# Altium schematic sheet Connectors.SchDoc
size A; SheetNumber: 1; SheetTotal: 6
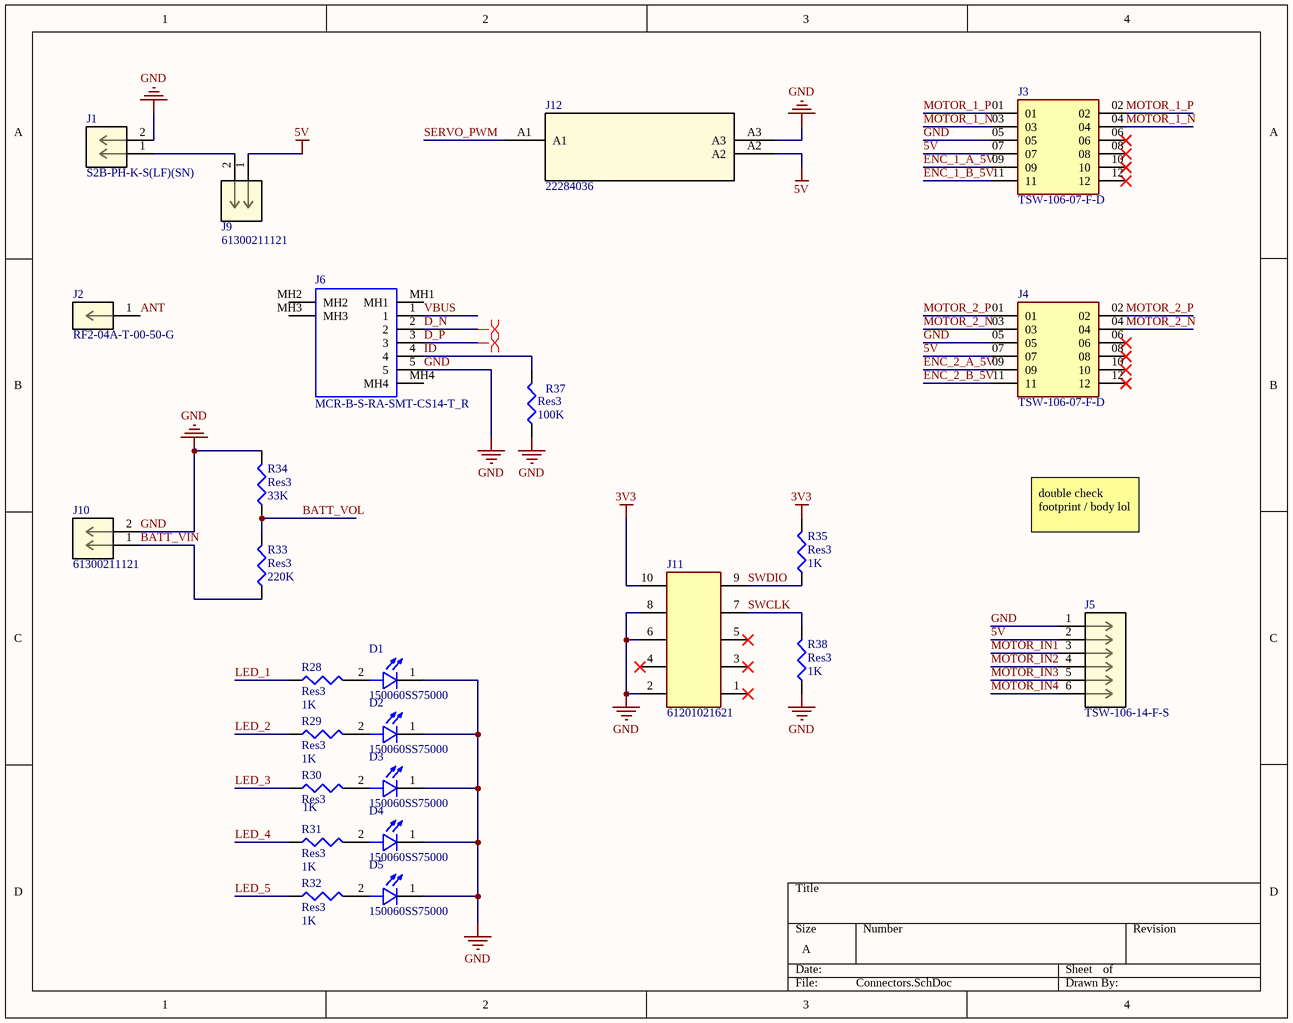
[diagram p0: Connectors.SchDoc]

## Parts
D1  150060SS75000  [LED_150060SS75000]
D2  150060SS75000  [LED_150060SS75000]
D3  150060SS75000  [LED_150060SS75000]
D4  150060SS75000  [LED_150060SS75000]
D5  150060SS75000  [LED_150060SS75000]
J1  S2B-PH-K-S(LF)(SN)  [CONN_S2B-PH-K-S_JST]
J2  RF2-04A-T-00-50-G  [CONN_RF2-04A-T-00-50-G_ADM]
J3  TSW-106-07-F-D  [SAMTEC_TSW-106-07-F-D]
J4  TSW-106-07-F-D  [SAMTEC_TSW-106-07-F-D]
J5  TSW-106-14-F-S  [CON6_1X6_TU_TSW]
J6  MCR-B-S-RA-SMT-CS14-T_R  [MCRBSRASMTCS14TR]
J9  61300211121  [CONN_61300211121_WRE]
J10  61300211121  [CONN_61300211121_WRE]
J11  61201021621  [61201021621]
J12  22284036  [22-28-4036_MOL]
R28  Res3  value 1K  [J1-0603]
R29  Res3  value 1K  [J1-0603]
R30  Res3  value 1K  [J1-0603]
R31  Res3  value 1K  [J1-0603]
R32  Res3  value 1K  [J1-0603]
R33  Res3  value 220K  [J1-0603]
R34  Res3  value 33K  [J1-0603]
R35  Res3  value 1K  [J1-0603]
R37  Res3  value 100K  [J1-0603]
R38  Res3  value 1K  [J1-0603]

## Nets
3V3: J11.10 R35.2
5V: J3.07 J4.07 J5.2 J9.1 J12.A2
GND: D1.1(C) D2.1(C) D3.1(C) D4.1(C) D5.1(C) J1.2 J3.05 J4.05 J5.1 J6.5 J10.2 J11.2 J11.6 J11.8 J12.A3 R34.2 R37.1 R38.1
ANT: J2.1
BATT_VIN: J10.1 R33.1
BATT_VOL: R33.2 R34.1
D_N: J6.2
D_P: J6.3
ENC_1_A_5V: J3.09
ENC_1_B_5V: J3.11
ENC_2_A_5V: J4.09
ENC_2_B_5V: J4.11
ID: J6.4 R37.2
LED_1: R28.1
LED_2: R29.1
LED_3: R30.1
LED_4: R31.1
LED_5: R32.1
MOTOR_1_N: J3.03 J3.04
MOTOR_1_P: J3.01 J3.02
MOTOR_2_N: J4.03 J4.04
MOTOR_2_P: J4.01 J4.02
MOTOR_IN1: J5.3
MOTOR_IN2: J5.4
MOTOR_IN3: J5.5
MOTOR_IN4: J5.6
SERVO_PWM: J12.A1
SWCLK: J11.7 R38.2
SWDIO: J11.9 R35.1
VBUS: J6.1
NetD1_2: D1.2(A) R28.2
NetD2_2: D2.2(A) R29.2
NetD3_2: D3.2(A) R30.2
NetD4_2: D4.2(A) R31.2
NetD5_2: D5.2(A) R32.2
NetJ1_1: J1.1 J9.2

Not connected (* = marked no-connect by the designer): J3 06* 08* 10* 12*; J4 06* 08* 10* 12*; J6 MH1 MH2 MH3 MH4; J11 1* 3* 4* 5*

## Layout directives
differential pair: D_N, D_P

## Notes on the sheet
- double check footprint / body lol

## Library data of the parts
D1-D5 = 150060SS75000: Standard LEDs - SMD WL-SMCW SMDMono TpVw Waterclr 0603 SprRed; MF: WÃ¼rth Elektronik; SnapEDA_Link: https://www.snapeda.com/parts/150060SS75000/W%C3%BCrth%20Elektronik/view-part/4805427/?ref=snap; Availability: Warning; Purchase-URL: https://pricing.snapeda.com/search/part/150060SS75000/?ref=eda; MP: 150060SS75000; Value: *; Price: None; Package: None; Check_prices: https://www.snapeda.com/parts/150060SS75000/W%C3%BCrth%20Elektronik/view-part/4805427/?ref=eda
J1 = S2B-PH-K-S(LF)(SN): No Description Available; Mfr_Name: JST; Copyright: Copyright (C) 2023 Ultra Librarian. All rights reserved.; Manufacturer_Part_Number: S2B-PH-K-S(LF)(SN); Digi-Key_Part_Number_1: 455-1719-ND; Digi-Key_Part_Number_2: 455-1719-NDL; RefDes: RefDes; Type: DEV
J2 = RF2-04A-T-00-50-G: No Description Available; Mfr_Name: ADAM TECHNOLOGIES INC; Copyright: Copyright (C) 2023 Ultra Librarian. All rights reserved.; Manufacturer_Part_Number: RF2-04A-T-00-50-G; Digi-Key_Part_Number_1: 2057-RF2-04A-T-00-50-G-ND; RefDes: RefDes; Type: DEV
J3 J4 = TSW-106-07-F-D: MF: Samtec; MP: TSW-106-07-F-D; Price: None; Package: None; Value: *; Availability: Unavailable
J5 = TSW-106-14-F-S: No Description Available; Mfr_Name: Samtec Inc; Copyright: Copyright (C) 2023 Ultra Librarian. All rights reserved.; Manufacturer_Part_Number: TSW-106-14-F-S; Digi-Key_Part_Number_1: SAM15379-ND; Digi-Key_Part_Number_2: TSW-106-14-F-S-ND; RefDes: RefDes; Type: DEV
J6 = MCR-B-S-RA-SMT-CS14-T_R: USB - micro B Receptacle Connector 5 Position Surface Mount, Right Angle; Manufacturer_Name: Adam Tech; Manufacturer_Part_Number: MCR-B-S-RA-SMT-CS14-T/R; Geometry.Height: 3.1mm; Mouser Part Number: *; Mouser Price/Stock: *; Arrow Part Number: MCR-B-S-RA-SMT-CS14-T/R; Arrow Price/Stock: https://www.arrow.com/en/products/mcr-b-s-ra-smt-cs14-tr/adam-tech?region=nac; Mouser Testing Part Number: *; Mouser Testing Price/Stock: *; Datasheet Link: https://app.adam-tech.com/products/download/data_sheet/195344/mcr-b-s-ra-smt-cs14-t-r-data-sheet.pdf
J9 J10 = 61300211121: No Description Available; Mfr_Name: Wurth Electronics; Copyright: Copyright (C) 2023 Ultra Librarian. All rights reserved.; Manufacturer_Part_Number: 61300211121; RefDes: RefDes; Type: DEV
J11 = 61201021621: Connector Header Through Hole 10 position 0.100 _2.54mm_; MF: Wurth Electronics; Price: None; Package: None; Value: *; MP: 61201021621; Availability: Unavailable; SnapEDA_Link: https://www.snapeda.com/parts/61201021621/Wurth%20Electronics%20Inc./view-part/1156232/?ref=snap
J12 = 22284036: No Description Available; Mfr_Name: Molex Connector Corporation; Copyright: Copyright (C) 2023 Ultra Librarian. All rights reserved.; Manufacturer_Part_Number: 22284036; RefDes: RefDes; Type: DEV
R28-R35 R37 R38 = Res3: Resistor; Published: 8-Jun-2000; LatestRevisionDate: 29-May-2009; LatestRevisionNote: IPC-7351 Footprint Added.; PackageReference: J1-0603; Publisher: Altium Limited; PackageDescription: Chip Resistor